# Altium schematic sheet Signal_generator.SchDoc
size A4
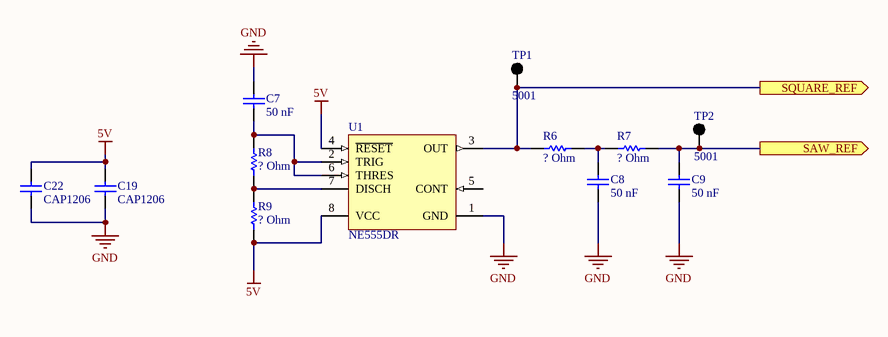
[diagram p0: Signal_generator.SchDoc]

## Parts
C7  50 nF  [CAPC0805(2012)75_M]
C8  50 nF  [CAPC0805(2012)75_M]
C9  50 nF  [CAPC0805(2012)75_M]
C19  CAP1206  [CAPC1206(3216)150_L]
C22  CAP1206  [CAPC1206(3216)150_L]
R6  ? Ohm  [RESC0805(2012)_M]
R7  ? Ohm  [RESC0805(2012)_M]
R8  ? Ohm  [RESC0805(2012)_M]
R9  ? Ohm  [RESC0805(2012)_M]
TP1  5001  [KSTN-5001]
TP2  5001  [KSTN-5001]
U1  NE555DR  [D0008A_M]

## Ports
SAW_REF (out), SQUARE_REF (out)

## Nets
5V: C19.2 C22.2 R9.2 U1.4(~{RESET}) U1.8(VCC)
GND: C7.1 C8.2 C9.2 C19.1 C22.1 U1.1(GND)
SAW_REF: C9.1 R7.2 TP2.1 ; port SAW_REF
SQUARE_REF: R6.1 TP1.1 U1.3(OUT) ; port SQUARE_REF
NetC7_2: C7.2 R8.1 U1.2(TRIG) U1.6(THRES)
NetC8_1: C8.1 R6.2 R7.1
NetR8_2: R8.2 R9.1 U1.7(DISCH)

Not connected (* = marked no-connect by the designer): U1 5(CONT)

## Library data of the parts
C7-C9 = CMP-1036-00018-1: CAP 0.5pF 50V ±0.1pF 0805 (2012 Metric) Thickness 0.75mm SMD; Case-EIA: 0805; Case-Metric: 2012; Tolerance: Â±0.1pF; Value: 0.5pF; Technology: SMT; Rated Voltage: 50 V; Max Thickness: 0.75 mm
C19 C22 = CMP-1590-00001-1: 1206 (3216 Metric) Chip Capacitor; Case-Metric: 3216; Case-EIA: 1206; PackageReference: CAPC1206(3216)150
R6-R9 = CMP-1013-00017-1: 4R3 0.125W 5% 0805 (2012 Metric)  SMD; Value: 4.30 Ohm; Case-Metric: 2012; Case-EIA: 0805; Tolerance: 5 %; Power: 0.125 W; Technology: SMT
TP1 TP2 = CMP-2000-05181-1: Test Point, Black, 1-Pin THD, RoHS, Bulk; Manufacturer: Keystone; Other Names: 5001K; Catalog Drawings: 5000Series; Kits: DKTGRS232C-KIT-ND / -TTLCONVERTER; Online Catalog: ColorCodedTestPoints; Datasheet URL: https://ciiva.com/datasheet-click-2917627?src=ciiva&sig=bd195616; Family: TestPoints; RoHS Information: RoHSComplianceStatement; Datasheet Version: Rev. G, 12/2008; Color: Black; Category: TestandMeasurement; Standard Package: 100; Manufacturer URL: http://www.keyelco.com/; Material: Base,Nylon46,UL94V-0; Type: PCTestPoint,Miniature; Series: THM; Packaging: Bulk
U1 = CMP-1685-00007-1: Precision Timer, 4.5 to 16 V, 0 to 70 degC, 8-Pin SOIC (D8), Green (RoHS & no Sb/Br), Tape and Reel; Forward Voltage: 450 mV; Forward Current: 1 A; Max Surge Current: 30 A; Peak Reverse Current: 500 uA; Case\Package: SMA; PackageReference: D0008A; Width: 2.84 mm; PackageDescription: 8-Pin Small Outline Integrated Circuit, Body 4.9 x 3.9 mm, Pitch 1.27 mm; DatasheetVersion: SLFS022I, 09/2014; ComponentLink2Description: Datasheet; Package Quantity: 1; REACH SVHC: Unknown; Radiation Hardening: No; Height: 2.44 mm; Code_JEDEC: MS-012; Pins: 2; ComponentLink1Description: Manufacturer URL; ComponentLink3Description: Package Specification; ComponentLink3URL: http://www.ti.com/lit/ml/msoi002j/msoi002j.pdf; Length: 4.57 mm; ComponentLink1URL: http://www.ti.com/; Mount: Surface Mount; PackageVersion: 4040047-3/M, 06/2011; ComponentLink2URL: http://www.ti.com/general/docs/lit/getliterature.tsp?genericPartNumber=NE555&fileType=pdf; RoHSCompliant: true; Max Operating Temperature: 125 degC; Packaging: Cut Tape; Min Operating Temperature: -55 degC